# EAGLE schematic Sensor_Unit_Schematic (EAGLE 6.4)
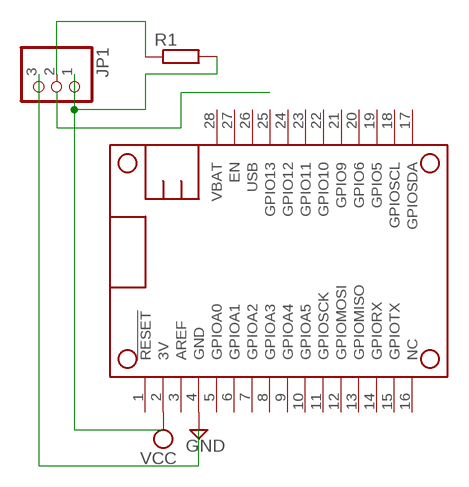
[diagram p0: schematic, sheet 1]

## Parts
JP1  PINHD-1X3  [1X03]
MS1  FEATHERWING_NODIM  [FEATHERWING_DIM]
R1  R-EU_0207/10  [0207/10]

## Nets
GND: MS1.4(GND)
N$1: JP1.1 R1.2
N$2: JP1.3
N$4: JP1.2 R1.1
VCC: MS1.2(3V)
Unconnected: MS1.1(!RESET) MS1.3(AREF) MS1.5(GPIOA0) MS1.6(GPIOA1) MS1.7(GPIOA2) MS1.8(GPIOA3) MS1.9(GPIOA4) MS1.10(GPIOA5) MS1.11(GPIOSCK) MS1.12(GPIOMOSI) MS1.13(GPIOMISO) MS1.14(GPIORX) MS1.15(GPIOTX) MS1.16(NC) MS1.17(GPIOSDA) MS1.18(GPIOSCL) MS1.19(GPIO5) MS1.20(GPIO6) MS1.21(GPIO9) MS1.22(GPIO10) MS1.23(GPIO11) MS1.24(GPIO12) MS1.25(GPIO13) MS1.26(USB) MS1.27(EN) MS1.28(VBAT)

## Library data of the parts
JP1 = pinhead:PINHD-1X3: PIN HEADER
MS1 = adafruit:FEATHERWING
R1 = rcl:R-EU_: RESISTOR, European symbol